# EAGLE design ArduLab (EAGLE 6.5.0)

## Sheet 1 of 2
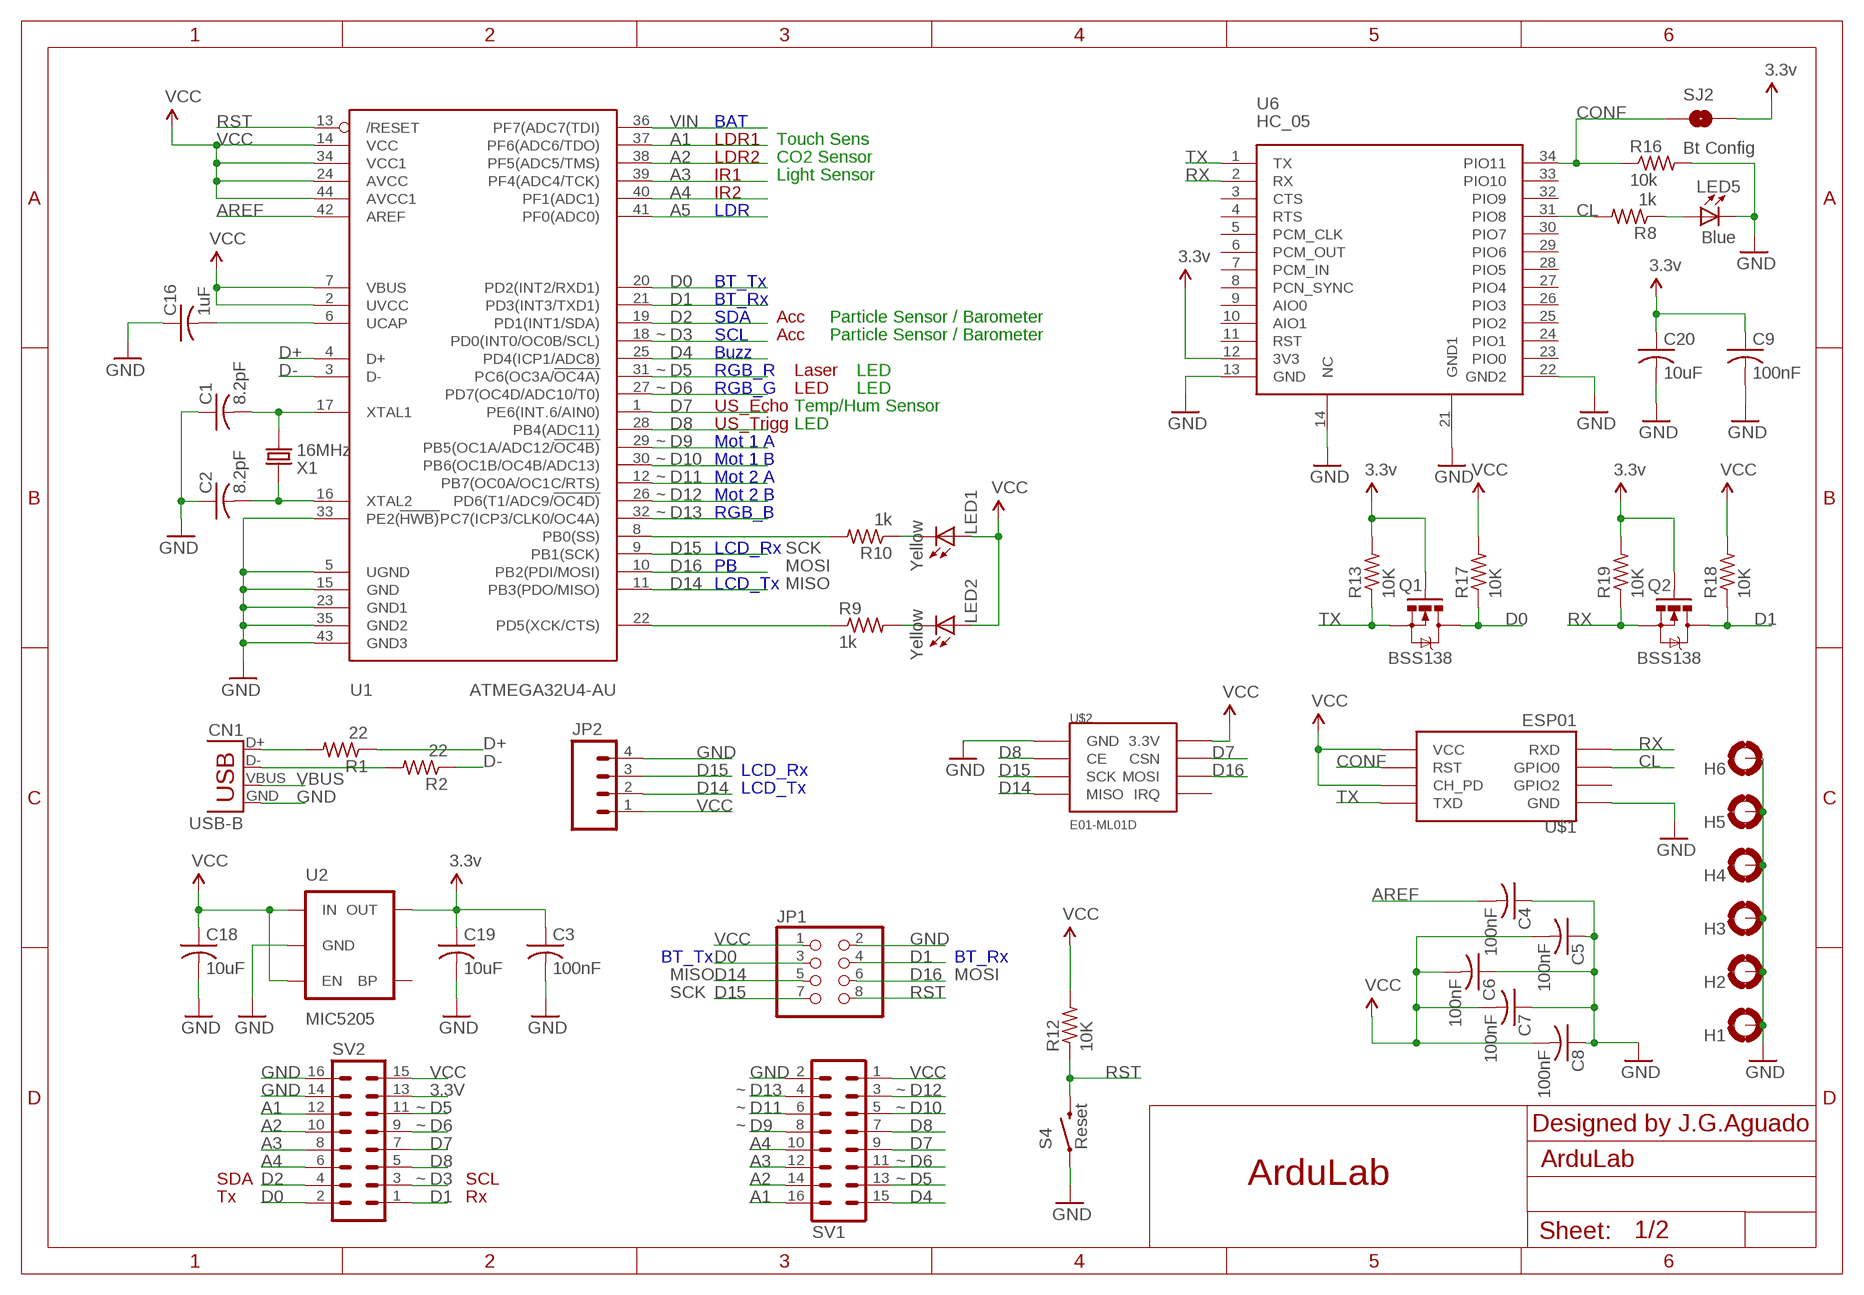
[diagram p0: schematic, sheet 1]

### Parts
C1  8.2pF  C-USC1206  [C1206]
C2  8.2pF  C-USC1206  [C1206]
C3  100nF  C-USC1206  [C1206]
C4  100nF  C-USC1206  [C1206]
C5  100nF  C-USC1206  [C1206]
C6  100nF  C-USC1206  [C1206]
C7  100nF  C-USC1206  [C1206]
C8  100nF  C-USC1206  [C1206]
C9  100nF  C-USC1206  [C1206]
C16  1uF  C-USC1206  [C1206]
C18  10uF  C-USC1206  [C1206]
C19  10uF  C-USC1206  [C1206]
C20  10uF  C-USC1206  [C1206]
CN1  USB-B  USBPTH  [USB-B-PTH]
H1  MOUNT-PAD-ROUND3.2  [3,2-PAD]
H2  MOUNT-PAD-ROUND3.2  [3,2-PAD]
H3  MOUNT-PAD-ROUND3.2  [3,2-PAD]
H4  MOUNT-PAD-ROUND3.2  [3,2-PAD]
H5  MOUNT-PAD-ROUND3.2  [3,2-PAD]
H6  MOUNT-PAD-ROUND3.2  [3,2-PAD]
JP1  PINHD-2X4  [2X04]
JP2  M04SMD  [1X04-SMD]
LED1  Yellow  LED1206  [LED1206]
LED2  Yellow  LED1206  [LED1206]
LED5  Blue  LED1206  [LED1206]
Q1  BSS138  MOSFET-NCHANNELSMD  [SOT23-3]
Q2  BSS138  MOSFET-NCHANNELSMD  [SOT23-3]
R1  22  R-US_R1206  [R1206]
R2  22  R-US_R1206  [R1206]
R8  1k  R-US_R1206  [R1206]
R9  1k  R-US_R1206  [R1206]
R10  1k  R-US_R1206  [R1206]
R12  10K  R-US_R1206  [R1206]
R13  10K  R-US_R1206  [R1206]
R16  10k  R-US_R1206  [R1206]
R17  10K  R-US_R1206  [R1206]
R18  10K  R-US_R1206  [R1206]
R19  10K  R-US_R1206  [R1206]
S4  Reset  SWITCH-MOMENTARY-2SMD-4  [TACTILE_SWITCH_TALL]
SJ2  Bt Config  SOLDERJUMPERROUND  [SJ_ROUND]
SV1  MA08-2  [MA08-2]
SV2  MA08-2  [MA08-2]
U1  ATMEGA32U4-AU  [TQFP44]
U2  MIC5205  V_REG_LDOSMD  [SOT23-5]
U6  HC_05  [BLUETOOTH_SMD]
U$1  ESP01  [ESP01]
U$2  E01-ML01D  [E01-ML01D]
X1  16MHz  CRYSTAL'5032'  [2P-SMD-5X3.2]

### Nets
3.3V: C3.1 C9.1 C19.1 C20.1 Q1.1(G) Q2.1(G) R13.2 R19.2 SJ2.2 SV2.13 U2.5(OUT) U6.12(3V3) U$1.CH_PD U$1.VCC U$2.P$2(3.3V) ; supply symbol labelled 3.3v, VCC
A1: SV1.16 SV2.12 U1.37(PF6(ADC6/TDO))
A2: SV1.14 SV2.10 U1.38(PF5(ADC5/TMS))
A3: SV1.12 SV2.8 U1.39(PF4(ADC4/TCK))
A4: SV1.10 SV2.6 U1.40(PF1(ADC1))
A5: U1.41(PF0(ADC0)) ; also sheet 2
AREF: C4.2 U1.42(AREF)
CL: R8.2 U6.31(PIO8) U$1.GPIO0
CONF: R16.1 SJ2.1 U6.34(PIO11) U$1.RST
D0: JP1.3 Q1.3(D) R17.1 SV2.2 U1.20(PD2(INT2/RXD1))
D1: JP1.4 Q2.3(D) R18.1 SV2.1 U1.21(PD3(INT3/TXD1))
D2: SV2.4 U1.19(PD1(INT1/SDA))
D3: SV2.3 U1.18(PD0(INT0/OC0B/SCL))
D4: SV1.15 U1.25(PD4(ICP1/ADC8)) ; also sheet 2
D5: SV1.13 SV2.11 U1.31(PC6(OC3A/!OC4A)) ; also sheet 2
D6: SV1.11 SV2.9 U1.27(PD7(OC4D/ADC10/T0)) ; also sheet 2
D7: SV1.9 SV2.7 U1.1(PE6(INT.6/AIN0)) U$2.P$4(CSN)
D8: SV1.7 SV2.5 U1.28(PB4(ADC11)) U$2.P$3(CE)
D9: SV1.8 U1.29(PB5(OC1A/ADC12/!OC4B)) ; also sheet 2
D10: SV1.5 U1.30(PB6(OC1B/OC4B/ADC13)) ; also sheet 2
D11: SV1.6 U1.12(PB7(OC0A/OC1C/RTS)) ; also sheet 2
D12: SV1.3 U1.26(PD6(T1/ADC9/!OC4D)) ; also sheet 2
D13: SV1.4 U1.32(PC7(ICP3/CLK0/OC4A)) ; also sheet 2
D14: JP1.5 JP2.2 U1.11(PB3(PDO/MISO)) U$2.P$7(MISO)
D15: JP1.7 JP2.3 U1.9(PB1(SCK)) U$2.P$5(SCK)
D16: JP1.6 U1.10(PB2(PDI/MOSI)) U$2.P$6(MOSI) ; also sheet 2
D17/PB0/RXLED: R10.2 U1.8(PB0(SS))
D+: R1.1 U1.4(D+)
D-: R2.1 U1.3(D-)
GND: C1.1 C2.1 C3.2 C4.1 C5.1 C6.1 C7.1 C8.1 C9.2 C16.1 C18.2 C19.2 C20.2 CN1.GND H1.B3,2(MOUNT) H2.B3,2(MOUNT) H3.B3,2(MOUNT) H4.B3,2(MOUNT) H5.B3,2(MOUNT) H6.B3,2(MOUNT) JP1.2 JP2.4 LED5.C R16.2 S4.A2 SV1.2 SV2.14 SV2.16 U1.5(UGND) U1.15(GND) U1.23(GND1) U1.33(PE2(!HWB)) U1.35(GND2) U1.43(GND3) U2.2(GND) U6.13(GND) U6.14(NC) U6.21(GND1) U6.22(GND2) U$1.GND U$2.P$1(GND) ; also sheet 2
N$2: C1.2 U1.17(XTAL1) X1.2
N$5: C2.2 U1.16(XTAL2) X1.1
N$6: LED2.C R9.2
N$8: LED1.C R10.1
N$12: CN1.D+ R1.2
N$13: CN1.D- R2.2
N$19: LED5.A R8.1
PD5/TXLED: R9.1 U1.22(PD5(XCK/CTS))
RST: JP1.8 R12.1 S4.B2 U1.13(/RESET)
RX: Q2.2(S) R19.1 U6.2(RX) U$1.RX(RXD)
TX: Q1.2(S) R13.1 U6.1(TX) U$1.TX(TXD)
UCAP: C16.2 U1.6(UCAP)
VBUS: CN1.VBUS ; also sheet 2
VCC: C5.2 C6.2 C7.2 C8.2 C18.1 JP1.1 JP2.1 LED1.A LED2.A R12.2 R17.2 R18.2 SV1.1 SV2.15 U1.2(UVCC) U1.7(VBUS) U1.14(VCC) U1.24(AVCC) U1.34(VCC1) U1.44(AVCC1) U2.1(IN) U2.3(EN) ; also sheet 2
VIN: U1.36(PF7(ADC7(TDI)) ; also sheet 2
Unconnected: U2.4(BP) U6.3(CTS) U6.4(RTS) U6.5(PCM_CLK) U6.6(PCM_OUT) U6.7(PCM_IN) U6.8(PCN_SYNC) U6.9(AIO0) U6.10(AIO1) U6.11(RST) U6.23(PIO0) U6.24(PIO1) U6.25(PIO2) U6.26(PIO3) U6.27(PIO4) U6.28(PIO5) U6.29(PIO6) U6.30(PIO7) U6.32(PIO9) U6.33(PIO10) U$1.GPIO2 U$2.P$8(IRQ)

### Notes on the sheet
- BAT
- LDR1 | Touch Sens
- LDR2 | CO2 Sensor
- IR1 | Light Sensor
- IR2
- LDR
- BT_Tx
- BT_Rx
- SDA | Acc | Particle Sensor / Barometer
- ~ | SCL | Acc | Particle Sensor / Barometer
- Buzz
- ~ | RGB_R | Laser | LED
- ~ | RGB_G | LED | LED
- US_Echo | Temp/Hum Sensor
- US_Trigg | LED
- ~ | Mot 1 A
- ~ | Mot 1 B
- ~ | Mot 2 A
- ~ | Mot 2 B
- ~ | RGB_B
- LCD_Rx | SCK
- PB | MOSI
- LCD_Tx | MISO
- LCD_Rx
- LCD_Tx
- BT_Tx | BT_Rx
- MISO | MOSI
- SCK
- ~ | ~
- ~ | ~ | ~
- ~ | ~ | Designed by J.G.Aguado
- ~
- SDA | ~ | SCL | ~ | ArduLab
- Tx | Rx

## Sheet 2 of 2
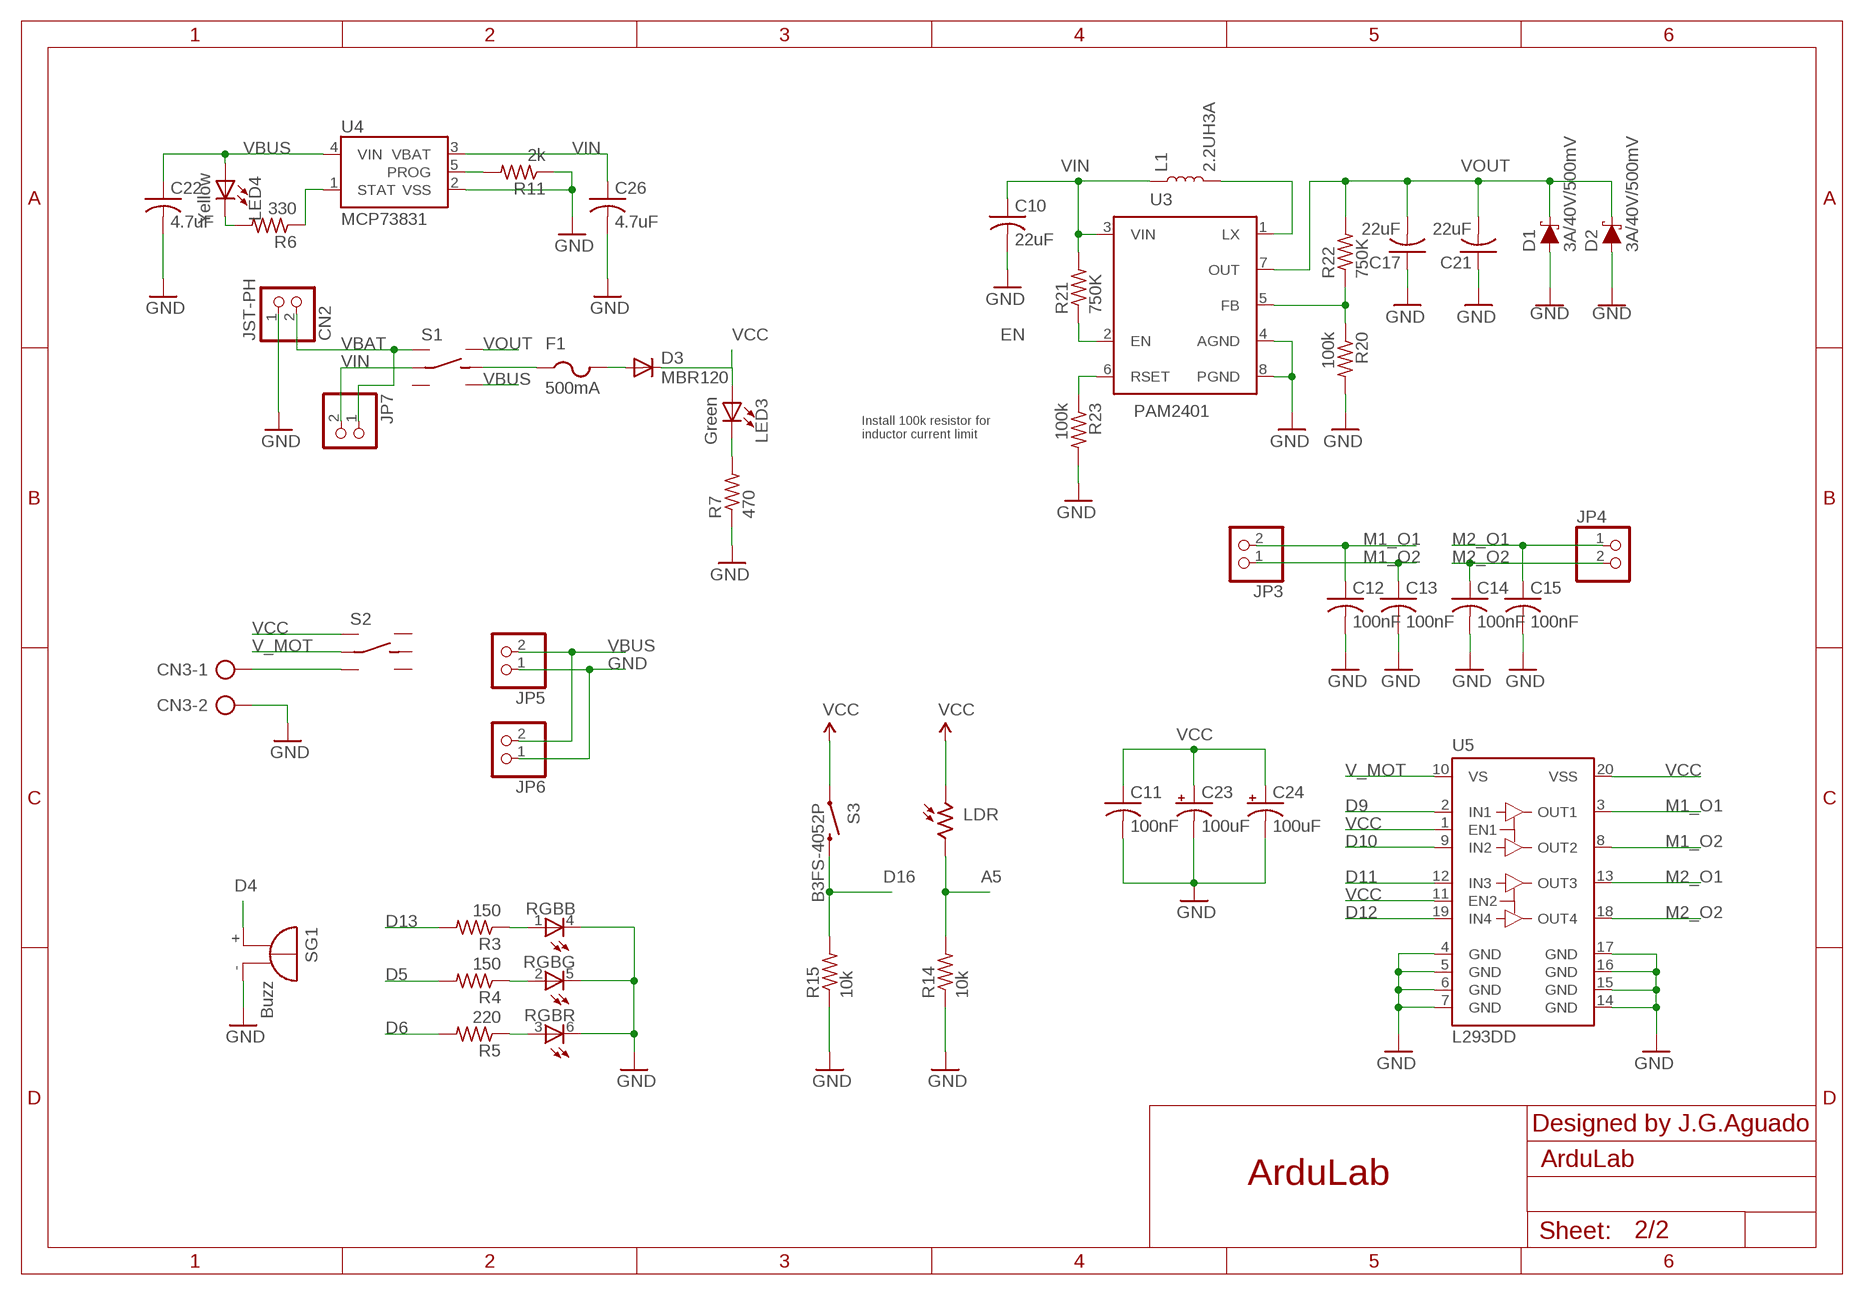
[diagram p1: schematic, sheet 2]

### Parts
C10  22uF  C-USC1206  [C1206]
C11  100nF  C-USC1206  [C1206]
C12  100nF  C-USC1206  [C1206]
C13  100nF  C-USC1206  [C1206]
C14  100nF  C-USC1206  [C1206]
C15  100nF  C-USC1206  [C1206]
C17  22uF  C-USC1206  [C1206]
C21  22uF  C-USC1206  [C1206]
C22  4.7uF  C-USC3216  [C3216]
C23  100uF  CAP_POL3528-KIT  [EIA3528-KIT]
C24  100uF  CAP_POL3528-KIT  [EIA3528-KIT]
C26  4.7uF  C-USC3216  [C3216]
CN2  JST-PH  JST_2PIN-SMT  [JST-PH-2-SMT]
CN3  AK500/2  [AK500/2]
D1  3A/40V/500mV  DIODE-SCHOTTKY-B340A  [SMA-DIODE]
D2  3A/40V/500mV  DIODE-SCHOTTKY-B340A  [SMA-DIODE]
D3  MBR120  DIODE-SOD123  [SOD123]
F1  500mA  PTCFUSE-1206  [R1206]
JP3  PINHD-1X2  [1X02]
JP4  PINHD-1X2  [1X02]
JP5  PINHD-1X2  [1X02]
JP6  PINHD-1X2  [1X02]
JP7  PINHD-1X2  [1X02]
L1  2.2UH3A  INDUCTOR-IFSC1515AHER2R2M01  [INDUCTOR_4X4MM]
LDR  VT20N1  [TO46-VT200]
LED3  Green  LED1206  [LED1206]
LED4  Yellow  LED1206  [LED1206]
R3  150  R-US_R1206  [R1206]
R4  150  R-US_R1206  [R1206]
R5  220  R-US_R1206  [R1206]
R6  330  R-US_R1206  [R1206]
R7  470  R-US_R1206  [R1206]
R11  2k  R-US_R1206  [R1206]
R14  10k  R-US_R1206  [R1206]
R15  10k  R-US_R1206  [R1206]
R20  100k  R-US_R1206  [R1206]
R21  750K  R-US_R1206  [R1206]
R22  750K  R-US_R1206  [R1206]
R23  100k  R-US_R1206  [R1206]
RGB  OVSTRGBBCR8_V2  [OVSTRGBBCR8_V2]
S1  DPDT_JS202011CQN  [DPDT_JS202011CQN]
S2  DPDT_JS202011CQN  [DPDT_JS202011CQN]
S3  B3FS-4052P  SWITCH-MOMENTARY-2SMD-12MM  [TACTILE-SMD-12MM]
SG1  Buzz  F/HMB  [F/HMB]
U3  PAM2401  [MSOP8]
U4  MCP73831  [SOT23-5]
U5  L293DD  [SO20]

### Nets
A5: LDR.2 R14.2 ; also sheet 1
D4: SG1.+ ; also sheet 1
D5: R4.2 ; also sheet 1
D6: R5.2 ; also sheet 1
D9: U5.2(IN1) ; also sheet 1
D10: U5.9(IN2) ; also sheet 1
D11: U5.12(IN3) ; also sheet 1
D12: U5.19(IN4) ; also sheet 1
D13: R3.2 ; also sheet 1
D16: R15.2 S3.3 ; also sheet 1
EN: R21.1 U3.2(EN)
GND: C10.2 C11.2 C12.2 C13.2 C14.2 C15.2 C17.1 C21.1 C22.2 C23.C(-) C24.C(-) C26.2 CN2.1 CN3.2 D1.A D2.A JP5.1 JP6.1 R7.1 R11.1 R14.1 R15.1 R20.2 R23.2 RGB.4(B:C) RGB.5(G:C) RGB.6(R:C) SG1.- U3.4(AGND) U3.8(PGND) U4.2(VSS) U5.4(GND) U5.5(GND) U5.6(GND) U5.7(GND) U5.14(GND) U5.15(GND) U5.16(GND) U5.17(GND) ; also sheet 1
M1_O1: C12.1 JP3.2 U5.3(OUT1)
M1_O2: C13.1 JP3.1 U5.8(OUT2)
M2_O1: C15.1 JP4.1 U5.13(OUT3)
M2_O2: C14.1 JP4.2 U5.18(OUT4)
N$1: R20.1 R22.1 U3.5(FB)
N$3: F1.1 S1.5(RC)
N$4: L1.P$2 U3.1(LX)
N$7: R23.1 U3.6(RSET)
N$9: LED4.C R6.2
N$10: R11.2 U4.5(PROG)
N$11: R6.1 U4.1(STAT)
N$14: LED3.C R7.2
N$15: D3.A F1.2
N$308: R3.1 RGB.1(B:A)
N$309: R4.1 RGB.2(G:A)
N$310: R5.1 RGB.3(R:A)
V_AUX: CN3.1 S2.3(L2)
V_MOT: S2.2(LC) U5.10(VS)
VBAT: CN2.2 JP7.1 S1.1(L1)
VBUS: C22.1 JP5.2 JP6.2 LED4.A S1.6(R2) U4.4(VIN) ; also sheet 1
VCC: C11.1 C23.A(+) C24.A(+) D3.C LDR.1 LED3.A S2.1(L1) S3.1 U5.1(EN1) U5.11(EN2) U5.20(VSS) ; also sheet 1
VIN: C10.1 C26.1 JP7.2 L1.P$1 R21.2 S1.2(LC) U3.3(VIN) U4.3(VBAT) ; also sheet 1
VOUT: C17.2 C21.2 D1.C D2.C R22.2 S1.4(R1) U3.7(OUT)
Unconnected: S1.3(L2) S2.4(R1) S2.5(RC) S2.6(R2)

### Notes on the sheet
- Install 100k resistor for
  inductor current limit
- Designed by J.G.Aguado
- ArduLab

## Library data of the parts
C1-C22 C26 = resistor:C-US: CAPACITOR, American symbol
C23 C24 = SparkFun:CAP_POL: Capacitor Polarized These are standard SMD and PTH capacitors. Normally 10uF, 47uF, and 100uF in electrolytic and tantalum varieties. Always verify the external diameter of the through hole cap, it varies with capacity, voltage, and manufacturer. The EIA devices should be standard.
CN1 = SparkFun-Connectors:USB: USB Connectors USB-B-PTH is fully proven SKU : PRT-00139/CONN-08278 USB-miniB is fully proven SKU : PRT-00587 USB-A-PCB is untested. USB-A-H is throughly reviewed, but untested. Spark Fun Electronics SKU : PRT-00437 USB-B-SMT is throughly reviewed, but untested. Needs silkscreen touching up. USB-A-S has not been used/tested USB-MB-H has not been used/tested USB-MICROB has been used. CONN-09505; PROD_ID: CONN-08278
CN2 = adafruit:JST_2PIN: JST 2-Pin Connectors of various flavors SMT-RA (S2B-PH-SM4) 4UConnector #17311 SMT (B2B-PH-SM4) THM-RA (S2B-PH) THM (B2B-PH)
CN3 = con-ptr500:AK500/2: CONNECTOR; OC_FARNELL: unknown; OC_NEWARK: unknown
D1 D2 = SparkFun-DiscreteSemi:DIODE-SCHOTTKY: Schottky diode A Schottky diode is a semiconductor diode which has a low forward voltage drop and a very fast switching action.; PROD_ID: DIO-09886
D3 = diode:DIODE-: DIODE
F1 = adafruit:PTCFUSE: PTC fuses, resettable thermistors
H1-H6 = holes:MOUNT-PAD-ROUND: MOUNTING PAD, round
JP1 = pinhead:PINHD-2X4: PIN HEADER
JP2 = SparkFun-Connectors:M04: Header 4 Standard 4-pin 0.1" header. Use with straight break away headers (SKU : PRT-00116), right angle break away headers (PRT-00553), swiss pins (PRT-00743), machine pins (PRT-00117), and female headers (PRT-00115). Molex polarized connector foot print use with SKU : PRT-08231 with associated crimp pins and housings. 1MM SMD Version SKU: PRT-10208
JP3-JP7 = pinhead:PINHD-1X2: PIN HEADER
L1 = SparkFun-Coils:INDUCTOR: Inductors Resist changes in electrical current. Basically a coil of wire. SparkFun Products: SparkFun Load Cell Amplifier - HX711 <https://www.sparkfun.com/products/13879> IOIO-OTG - V2.2 <https://www.sparkfun.com/products/13613>; PROD_ID: NDUC-13770
LDR = photo-elements:VT2*: Photoconductive Cell VT200 Series Source: http://optoelectronics.perkinelmer.com/content/Datasheets/DTS_vt200seriesdatasheet.pdf
LED1-LED5 = SpaceDIY_passive_components:LED1206
Q1 Q2 = SparkFun:MOSFET-NCHANNEL
R1-R23 = resistor:R-US_: RESISTOR, American symbol
RGB = led:OVSTRGBBCR8_V2
S1 S2 = bt_electromech:DPDT: Dual Position, Dual Throw (DPDT) Switch
S3 = SparkFun-Electromechanical:SWITCH-MOMENTARY-2: Various NO switches- pushbuttons, reed, etc
S4 = Testing:SWITCH-MOMENTARY-2: Various NO switches- pushbuttons, reed, etc
SG1 = buzzer:F/HMB: BUZZER Source: Buerklin; OC_FARNELL: unknown; OC_NEWARK: unknown
SJ2 = SparkFun-Retired:SOLDERJUMPER: Solder Jumper Standard SMD solder jumper. Used to automate production. Two varients : Normally Open and Normally Closed are the same, but have different paste layers. NC will have a large amount of paste and should jumper during reflow.
SV1 SV2 = con-lstb:MA08-2: PIN HEADER; OC_FARNELL: unknown; OC_NEWARK: unknown
U1 = adafruit:ATMEGA32U4: http://www.ladyada.net/library/eagle
U2 = SparkFun:V_REG_LDO: Voltage Regulator LDO Standard 150mA LDO voltage regulator in SOT-23 layout. Micrel part MIC5205. BP (by-pass) pin is used to lower output noise with 470pF cap.
U3 = SparkFun-IC-Power:PAM2401: PAM2401 - Boost PMIC Specifications: Up to 1A output current 0.9V to 4.75V Input Range 2.5V to 5.0V Adjustable Output Voltage Datasheet <https://www.diodes.com/assets/Datasheets/PAM2401.pdf> (Diodes inc.); PROD_ID: IC-13769
U4 = SparkFun-PowerIC:MCP73831: Miniature single cell, fully integrated Li-Ion, Li-polymer charge management controller http://ww1.microchip.com/downloads/en/DeviceDoc/20001984g.pdf IC-09995; PROD_ID: IC-09995
U5 = st-microelectronics:L293DD: PUSH-PULL FOUR CHANNEL DRIVER WITH DIODES Source: http://www.st.com/stonline/books/pdf/docs/1330.pdf; OC_FARNELL: unknown
U6 = Bluetooth HC-05:HC_05: HC-05 Bluetooth Module
U$1 = esp8266modules:ESP01: ESP8266 Wifi module 01
U$2 = SpaceDIY_connectors:E01-ML01D: E01-ML01D 2.4 GHz RF Transceptor Module Based on the nRF24L01+ IC
X1 = Discrete:CRYSTAL*: CRYSTAL

## Net classes
0 default: width 0.152 mm, drill 0.305 mm, clearance 0.152 mm
1 vcc: width 0.254 mm

## Board
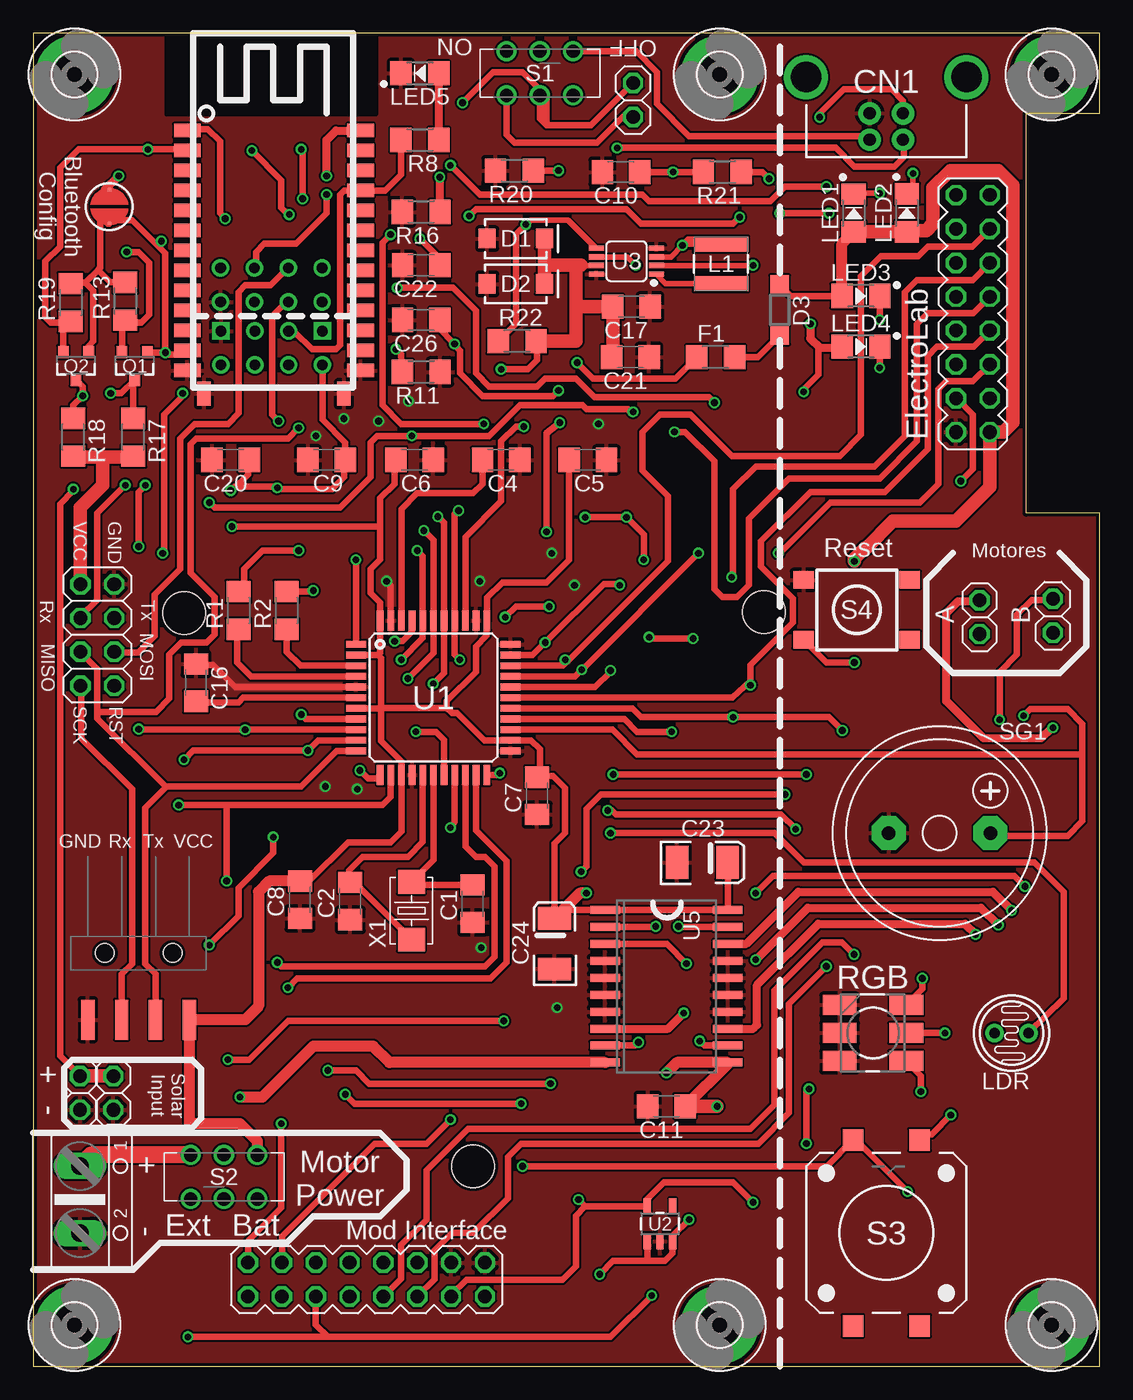
[diagram p2: board, top side]
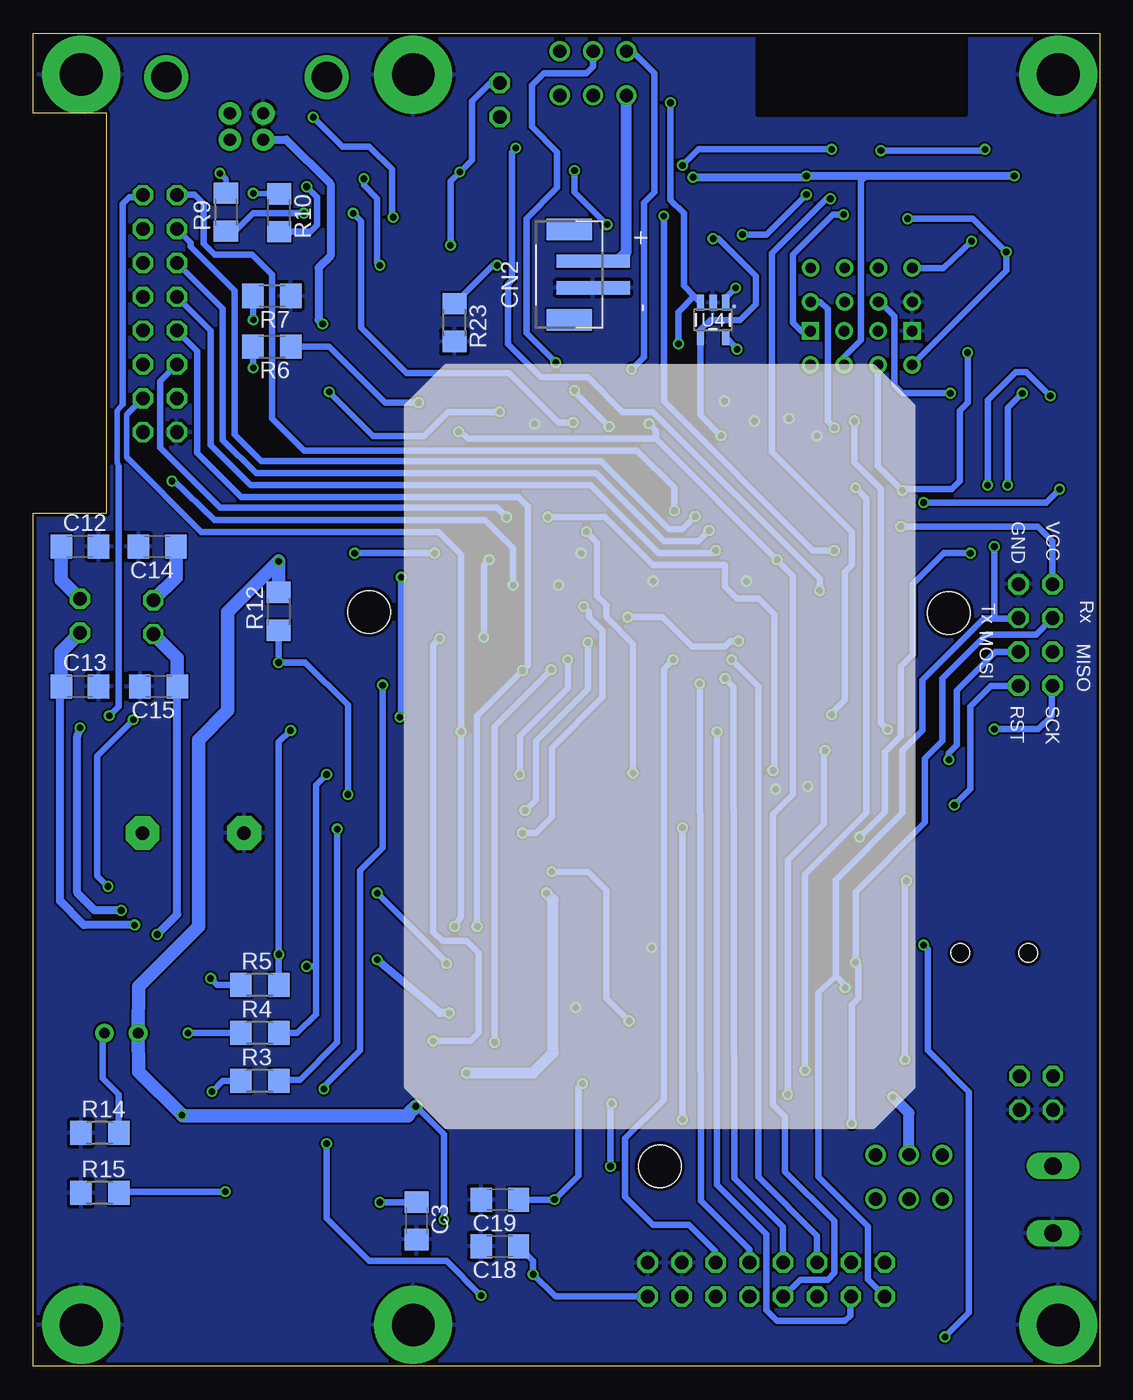
[diagram p3: board, bottom side, seen from below]

Size 80 x 100 mm. Coordinates in mm from the lower left corner, seen from the top.
Outline: 0,0 80,0 80,64 74.5,64 74.5,94 80,94 80,100 0,100 0,0
Copper layers (1*16): Top 0.035mm / dielectric 1.5mm / Bottom 0.035mm
Design rules "ITead_rule": minimum track width 6mil, minimum drill 12mil, track to track 6mil, track to pad 6mil, pad to pad 6mil, via to via 6mil, smd to smd 0mil, copper to edge 10mil, drill to drill 10mil, minimum pad ring 10mil, minimum via ring 6mil, stop-mask expansion 2mil, vias tented up to drill 100mil, thermal gap 10mil
Holes 3.2 mm at 54.8,56.6 11.3,56.5 33,15
tRestrict: area 10,93.9 to 25.7,100
bRestrict: area 10,93.9 to 25.7,100

### Footprints (pad centres in the part's own frame; a part is rotated, then mirrored left to right if it is on the bottom)
C1206 = smd 1.6 x 1.8: 1 -1.4,0; 2 1.4,0
C3216 = smd 1.6 x 1.8: 1 -1.4,0; 2 1.4,0
EIA3528-KIT = smd 1.7 x 2.5: A 1.9,0; C -1.9,0
USB-B-PTH = drill 0.914 pad 1.676: D+ 0,1.25; D- 1.981,1.25; GND 0,-1.25; VBUS 1.981,-1.25 | drill 2.286: S1 -2.718,-6.02; S2 -2.718,6.02
JST-PH-2-SMT = smd 1 x 5.5: 1 -1,-1.8; 2 1,-1.8 | smd 1.6 x 3.4: NC1 -3.4,0; NC2 3.4,0
AK500/2 = drill 1.321 long: 1 -2.515,0; 2 2.515,0
SMA-DIODE = smd 1.27 x 1.47: A -2.15,0; C 2.15,0
SOD123 = smd 1.4 x 1.4: A 1.9,0; C -1.9,0
R1206 = smd 1.6 x 1.803: 1 -1.422,0; 2 1.422,0
3,2-PAD = drill 3.2 pad 5.842: B3,2 0,0
2X04 = drill 1.016 octagon: 1 -3.81,-1.27; 2 -3.81,1.27; 3 -1.27,-1.27; 4 -1.27,1.27; 5 1.27,-1.27; 6 1.27,1.27; 7 3.81,-1.27; 8 3.81,1.27
1X04-SMD = smd 1 x 3: 1 -3.81,5; 2 -1.27,5; 3 1.27,5; 4 3.81,5 | hole 1.4: -2.54,0; 2.54,0
1X02 = drill 1.016 octagon: 1 -1.27,0; 2 1.27,0
INDUCTOR_4X4MM = smd 4.089 x 1.143: P$1 0,1.473; P$2 0,-1.473
TO46-VT200 = drill 0.8 pad 1.4: 1 -1.27,0; 2 1.27,0
LED1206 = smd 1.6 x 1.803: A -1.422,0; C 1.422,0
SOT23-3 = smd 0.8 x 0.9: 1 -0.95,-1; 2 0.95,-1; 3 0,1.1
OVSTRGBBCR8_V2 = smd 2.54 x 1.5: 1 -2.5,2.1; 2 -2.5,0; 3 -2.5,-2.1; 4 2.5,2.1; 5 2.5,0; 6 2.5,-2.1
DPDT_JS202011CQN = drill 1: 1 -2.5,-1.65; 2 0,-1.651; 3 2.5,-1.65; 4 -2.5,1.65; 5 0,1.651; 6 2.5,1.65
TACTILE-SMD-12MM = smd 1.6 x 1.55: 1 6.975,-2.5; 2 -6.975,-2.5; 3 6.975,2.5; 4 -6.975,2.5
TACTILE_SWITCH_TALL = smd 1.55 x 1.3: A1 -3.975,-2.25; A2 3.975,-2.25; B1 -3.975,2.25; B2 3.975,2.25
F/HMB = drill 1.016 pad 2.54 octagon: + 3.81,0; - -3.81,0
SJ_ROUND = smd 0.152 x 0.305: 1 -1.27,0; 2 1.27,0
MA08-2 = drill 1.016 octagon: 1 -8.89,-1.27; 2 -8.89,1.27; 3 -6.35,-1.27; 4 -6.35,1.27; 5 -3.81,-1.27; 6 -3.81,1.27; 7 -1.27,-1.27; 8 -1.27,1.27; 9 1.27,-1.27; 10 1.27,1.27; 11 3.81,-1.27; 12 3.81,1.27; 13 6.35,-1.27; 14 6.35,1.27; 15 8.89,-1.27; 16 8.89,1.27
TQFP44 = smd 1.5 x 0.5: 1 -5.8,4; 2 -5.8,3.2; 3 -5.8,2.4; 4 -5.8,1.6; 5 -5.8,0.8; 6 -5.8,0; 7 -5.8,-0.8; 8 -5.8,-1.6; 9 -5.8,-2.4; 10 -5.8,-3.2; 11 -5.8,-4; 23 5.8,-4; 24 5.8,-3.2; 25 5.8,-2.4; 26 5.8,-1.6; 27 5.8,-0.8; 28 5.8,0; 29 5.8,0.8; 30 5.8,1.6; 31 5.8,2.4; 32 5.8,3.2; 33 5.8,4 | smd 0.5 x 1.5: 12 -4,-5.8; 13 -3.2,-5.8; 14 -2.4,-5.8; 15 -1.6,-5.8; 16 -0.8,-5.8; 17 0,-5.8; 18 0.8,-5.8; 19 1.6,-5.8; 20 2.4,-5.8; 21 3.2,-5.8; 22 4,-5.8; 34 4,5.8; 35 3.2,5.8; 36 2.4,5.8; 37 1.6,5.8; 38 0.8,5.8; 39 0,5.8; 40 -0.8,5.8; 41 -1.6,5.8; 42 -2.4,5.8; 43 -3.2,5.8; 44 -4,5.8
SOT23-5 = smd 0.55 x 1.2: 1 -0.95,-1.3; 2 0,-1.3; 3 0.95,-1.3; 4 0.95,1.3; 5 -0.95,1.3
MSOP8 = smd 0.4 x 1.1: 1 -0.975,-2.25; 2 -0.325,-2.25; 3 0.325,-2.25; 4 0.975,-2.25; 5 0.975,2.25; 6 0.325,2.25; 7 -0.325,2.25; 8 -0.975,2.25
SO20 = smd 0.6 x 2.2: 1 -5.715,-4.6; 2 -4.445,-4.6; 3 -3.175,-4.6; 4 -1.905,-4.6; 5 -0.635,-4.6; 6 0.635,-4.6; 7 1.905,-4.6; 8 3.175,-4.6; 9 4.445,-4.6; 10 5.715,-4.6; 11 5.715,4.6; 12 4.445,4.6; 13 3.175,4.6; 14 1.905,4.6; 15 0.635,4.6; 16 -0.635,4.6; 17 -1.905,4.6; 18 -3.175,4.6; 19 -4.445,4.6; 20 -5.715,4.6
BLUETOOTH_SMD = smd 2 x 1: 1 -6.35,3.81; 2 -6.35,2.31; 3 -6.35,0.81; 4 -6.35,-0.69; 5 -6.35,-2.19; 6 -6.35,-3.69; 7 -6.35,-5.19; 8 -6.35,-6.69; 9 -6.35,-8.19; 10 -6.35,-9.69; 11 -6.35,-11.19; 12 -6.35,-12.69; 13 -6.35,-14.19; 22 6.65,-14.19; 23 6.65,-12.69; 24 6.65,-11.19; 25 6.65,-9.69; 26 6.65,-8.19; 27 6.65,-6.69; 28 6.65,-5.19; 29 6.65,-3.69; 30 6.65,-2.19; 31 6.65,-0.69; 32 6.65,0.81; 33 6.65,2.31; 34 6.65,3.81 | smd 1 x 1.8: 14 -5.1,-15.94; 21 5.4,-15.94
ESP01 = drill 0.8: CH_PD -1.285,-8.178; GPIO0 1.255,-5.638; GPIO2 -1.285,-5.638; RST 1.255,-8.178; TX -3.825,-8.178; VCC 3.795,-8.178 | drill 0.8 square: GND -3.825,-5.638; RX 3.795,-5.638
E01-ML01D = drill 0.8: P$1 2.45,1.25; P$2 2.45,3.79; P$3 4.99,1.25; P$4 4.99,3.79; P$5 7.53,1.25; P$6 7.53,3.79; P$7 10.07,1.25; P$8 10.07,3.79
2P-SMD-5X3.2 = smd 1.778 x 2.032: 1 -2.159,0; 2 2.159,0

### Placement (x,y rotation side)
C1  32.97,34.7 90 top
C2  23.77,34.89 90 top
C3  51.25,10.91 270 bottom
C4  35.1,68 180 top
C5  41.6,68 180 top
C6  28.6,68 180 top
C7  37.8,42.8 90 top
C8  20,35 90 top
C9  22,68 180 top
C10  44.1,89.6 180 top
C11  47.5,19.5 180 top
C12  76.5,61.5 0 bottom
C13  76.5,51 0 bottom
C14  70.7,61.5 180 bottom
C15  70.6,51 180 bottom
C16  12.2,51.28 270 top
C17  44.88,79.48 180 top
C18  45,9 180 bottom
C19  45,12.5 180 bottom
C20  14.8,68 180 top
C21  44.8,75.7 180 top
C22  29.1,82.6 180 top
C23  50.2,37.8 0 top
C24  39.1,31.7 90 top
C26  29.1,78.5 180 top
CN1  64,94 270 top
CN2  39.8,81.9 90 bottom
CN3  3.5,12.5 270 top
D1  36.2,84.6 0 top
D2  36.2,81.2 0 top
D3  56,79.25 270 top
F1  51.2,75.7 0 top
H1  76.4,3.1 0 top
H2  3.1,3.1 0 top
H3  3.1,96.9 0 top
H4  51.5,96.9 0 top
H5  76.4,96.9 0 top
H6  51.5,3.1 0 top
JP1  4.8,54.86 270 top
JP2  7.9,31 180 top
JP3  76.5,56.3 90 top
JP4  71,56.2 90 top
JP5  3.5,20.5 90 top
JP6  6,20.5 90 top
JP7  45,95 90 top
L1  51.6,82.7 0 top
LDR  73.4,25 0 top
LED1  61.55,86.51 90 top
LED2  65.55,86.53 90 top
LED3  62.1,80.3 0 top
LED4  62.1,76.5 0 top
LED5  29,97 180 top
Q1  7.6,75.1 180 top
Q2  3.2,75.1 180 top
R1  15.4,56.7 90 top
R2  19,56.7 90 top
R3  63,21.4 0 bottom
R4  63,25 0 bottom
R5  63,28.6 0 bottom
R6  62.1,76.5 180 bottom
R7  62.1,80.3 180 bottom
R8  29,92 180 top
R9  65.55,86.58 90 bottom
R10  61.55,86.54 270 bottom
R11  29.1,74.6 180 top
R12  61.6,56.63 90 bottom
R13  6.9,79.9 90 top
R14  75,17.5 0 bottom
R15  75,13 0 bottom
R16  29.1,86.6 180 top
R17  7.5,69.7 270 top
R18  3,69.7 270 top
R19  2.8,79.8 90 top
R20  36.1,89.7 180 top
R21  51.7,89.6 180 top
R22  36.3,76.9 0 top
R23  48.4,78.3 270 bottom
RGB  63,25 180 top
S1  38,97 0 top
S2  14.3,14.2 180 top
S3  64,10 90 top
S4  61.78,56.75 180 top
SG1  68,40 0 top
SJ2  5.7,87 270 top
SV1  70.5,78.97 90 top
SV2  25,6.5 0 top
U1  30.02,50.16 0 top
U2  47.02,10.68 0 top
U3  44.5,82.9 90 top
U4  29,78.5 180 bottom
U5  47.5,28.5 270 top
U6  17.9,88.9 0 top
U$1  17.9,83.3 0 top
U$2  11.6,78.6 0 top
X1  28.37,34.17 90 top

### Tracks (layer width: path | path; a pad name or v marks a point on that pad's centre or on a via)
3.3V  (via drill 0.5)
  Top 0.406: 41.45,11.98 41.38,11.98 41.38,12.02 v40.9,12.5
  Top 0.5: 41.45,11.98 U2.5 46.07,12.57 47.3,13.8 52.5,13.8 v54,12.3 | v38.8,21.2 25.2,21.2 24.2,22.2 v22.1,22.2 | 18.2,65.8 18.2,66 | 18.2,66 v18.3,65.9 18.4,65.8 22.4,65.8 23.3,66.7 23.3,68.1 C9.1 23.4,69.3 21.7,71 U$1.VCC | 5,86.3 SJ2.2 | SJ2.2 5.57,85.73 5,86.3 | 7.48,81.9 R13.2 5.78,81.32 4.85,82.25 | Q2.1 4.15,76.55 4.5,76.9 4.5,80.7 3.9,81.3 | 5,86.3 5,82.4 4.85,82.25 | 4.85,82.25 3.9,81.3 | v9.9,76.05 8.6,76.05 Q1.1 | v9.9,76.05 9.9,83.5 9.4,84 | 9.4,84 7.4,86 5.97,86 SJ2.2 | 3.9,81.3 2.88,81.3 R19.2 | 41.38,11.98 40.7,11.3 40.7,7.5 39.7,6.5 32.5,6.5 31.35,5.35 SV2.13 | v9.9,76.05 9.9,75.9 12.1,75.9 12,76.3 12.1,76.21 U6.12 | v9.6,84.4 9.7,84.4 9.4,84 | 18.2,66 15.1,66 v14.8,65.7 14.8,65.8 15,65.8 16.1,66.9 16.1,67.9 C20.1
  Bottom 0.5: v54,12.3 C3.1 | C19.1 v40.9,12.5 39.1,14.3 39.1,20.9 v38.8,21.2 | v22.1,22.2 22.1,36.9 17.5,41.5 17.5,65.1 v18.3,65.9 | U$2.P$2 11.71,82.39 v9.6,84.4 | v9.9,76.05 9.9,72.3 10.5,71.7 10.5,66.4 11.1,65.8 14.7,65.8 v14.8,65.7 16.61,67.52 U$1.CH_PD
A1  (via drill 0.5)
  Top 0.5: v31.9,64.2 31.62,63.92 U1.37 31.62,53.38 v32,53
  Bottom 0.406: 69.19,87.9 SV1.16
  Bottom 0.5: v31.9,64.2 31.9,65.9 34.7,68.7 59.7,68.7 62.1,71.1 62.1,81.9 63.6,83.4 66.4,83.4 67.2,84.2 67.2,87.2 67.9,87.9 69.19,87.9 | 32.54,52.46 v32,53 32.7,52.3 32.7,20 35.6,17.1 35.6,12.7 33.5,10.6 30.8,10.6 28.84,8.64 28.84,7.8 SV2.12
A2  (via drill 0.5)
  Top 0.5: v30.35,63.75 30.82,63.28 U1.38 30.82,52.02 v30,51.2
  Bottom 0.5: 30.3,63.8 v30.35,63.75 31.3,62.8 32.3,62.8 37.4,67.9 62.9,67.9 64.9,69.9 64.9,80.7 68.2,84 68.2,84.29 SV1.14 | SV2.10 26.27,8.77 29.9,12.4 29.97,51.17 v30,51.2
A3  (via drill 0.5)
  Top 0.5: v29.3,62.7 30.02,61.98 U1.39 30.02,53.52 v28.1,51.6
  Bottom 0.5: 29.2,62.8 v29.3,62.7 30.1,61.9 32.7,61.9 37.8,67 63.3,67 65.8,69.5 65.8,79.35 SV1.12 | v28.1,51.6 27.46,50.96 27.4,14.1 23.76,10.46 23.76,7.8 SV2.8
A4  (via drill 0.5)
  Top 0.5: v28.8,61.2 29.22,60.78 U1.40 29.22,54.62 v27.6,53
  Bottom 0.5: 29.1,61 33.1,61 38.2,66.1 63.7,66.1 66.7,69.1 66.7,77.71 SV1.10 | 29.1,61 29,61 v28.8,61.2 28.9,61.2 29.1,61 | v27.6,53 25.6,51 25.6,14.2 24.9,13.5 25.5,14.1 21.2,9.8 SV2.6
A5  (via drill 0.5)
  Top 0.5: U1.41 28.42,55.12 27.7,54.4 v27.1,54.4 | v43.3,40 55.6,40 57.8,37.8 75.1,37.8 77.3,35.6 77.3,27.6 LDR.2 | v38.7,57 36.2,57 v35.4,56.2
  Bottom 0.5: v43.3,40 42.3,40 41.1,41.2 41.1,46.4 37.3,50.2 37.3,55.2 38.3,56.2 38.3,56.6 v38.7,57 | R14.2 73.58,20.38 74.8,21.6 74.8,25.1 LDR.2 | v35.4,56.2 32.8,56.2 30.6,54 28.1,54 27.7,54.4 v27.1,54.4
AREF
  Top 0.5: U1.42 27.62,64.32 28.8,65.5 33,65.5 33.7,66.2 C4.2
CL
  Top 0.5: R8.2 27.6,91.98 27.6,89.4 26.41,88.21 U6.31 24.31,88.21 24.31,88.2 23.3,88.2 23,87.9 23,76.6 22.7,76.3 20.9,76.3 19.6,77.6 19.5,77.66 U$1.GPIO0
CONF  (via drill 0.5)
  Top 0.5: 24.24,92.7 U6.34
  Top 0.61: R16.1 30.52,89.02 v30.5,89.2 | v22,89.3 22,92 22.7,92.7 24.24,92.7 | SJ2.1 5.37,88.27 v6.4,89.3
  Bottom 0.5: U$1.RST 19.16,75.75 17.9,77 17.9,88.9 17.5,89.3
  Bottom 0.61: v30.5,89.2 22.1,89.2 v22,89.3 17.5,89.3 v6.4,89.3
D0  (via drill 0.5)
  Top 0.5: U1.20 32.42,38.98 33.2,38.2 33.9,38.2 34.6,37.5 34.6,30.7 33.9,30 18.6,30 v18.3,30.3 | JP1.3 3.53,56.23 4.8,57.5 4.8,64 v6.9,66.1 | v5.8,73 6.6,73 Q1.3 7.5,73.9 R17.1 | SV2.2 16.11,9.41 18.6,11.9 v18.6,18.2
  Bottom 0.406: 18.1,30.1 v18.3,30.3
  Bottom 0.5: v18.3,30.3 18.3,35.6 13.1,40.8 13.1,45.6 11.8,46.9 11.8,51.6 8.5,54.9 4.76,54.9 JP1.3 | v6.9,66.1 6.9,71.9 v5.8,73 | 18.1,30.1 18.1,27.6 18.6,27.1 v18.6,18.2
D1  (via drill 0.5)
  Top 0.5: U1.21 33.22,40.18 35.5,37.9 35.5,30.3 34.3,29.1 19.8,29.1 v19.1,28.4 | Q2.3 3.7,73.5 v3.7,72.8 3,72.1 R18.1 | v7.9,61.5 7.9,65.6 v8.4,66.1
  Bottom 0.406: 21.1,28 19.8,29.3
  Bottom 0.5: v19.1,28.4 19.1,28.6 19.8,29.3 19.8,36.5 14.8,41.5 14.8,46.2 13.3,47.7 13.3,51.5 8.7,56.1 7.9,56.1 | JP1.4 6.1,56.1 7.9,56.1 | v3.7,72.8 5.5,74.6 6.3,74.6 8.4,72.5 v8.4,66.1 | 21.1,28 21.1,14.2 17.4,10.5 17.4,6.52 SV2.1 | v7.9,61.5 7.9,56.1
D2  (via drill 0.5)
  Top 0.5: v31.3,18.5 29.5,16.7 25.6,16.7 18.65,9.75 SV2.4 | U1.19 31.62,40.82 v31.3,40.4
  Bottom 0.5: v31.3,18.5 v31.3,40.4
D3  (via drill 0.5)
  Top 0.5: U1.18 30.82,46.98 30.2,47.6 v28.7,47.6
  Bottom 0.5: v28.7,47.6 28.7,13.6 25,9.9 25,4.2 24.2,3.4 19.1,3.4 18.7,3.8 18.7,5.18 SV2.3
D4  (via drill 0.5)
  Top 0.5: SG1.+ 72.01,39.8 77.6,39.8 78.7,40.9 78.7,45.9 | U1.25 43.44,47.76 45.3,45.9 78.7,45.9 | 78.7,45.9 78.7,48.2 77.6,49.3 74.8,49.3 v74.3,48.8
  Bottom 0.406: 73.3,72.2 73.7,71.7 73.7,67.8 73.6,67.5
  Bottom 0.5: v74.3,48.8 73.6,49.5 73.6,67.5 | SV1.15 71.81,87.9 72.01,87.7 72.8,87.7 73.3,87.2 73.3,72.2
D5  (via drill 0.5)
  Top 0.5: U1.31 39.76,52.56 40.25,53.05 | 40.25,53.05 47.6,60.4 47.6,65.3 45.7,67.2 45.7,70.1 47,71.4 49.3,71.4 52.4,68.3 60.5,68.3 62.1,69.9 62.1,81.8 63.6,83.3 66.4,83.3 67.1,84 70.45,84 SV1.13 | v58,44.4 v43.5,44.4 | v39.9,53 40.25,53.05 | v59.5,30 56.7,27.2 56.7,19 54.4,16.7 36.6,16.7 35.6,15.7 35.6,12.6 33,10 31.4,10 30.1,8.7 30.1,6.52 SV2.11
  Bottom 0.5: R4.2 60.2,25 58.8,26.4 58.8,30 | 58.8,30 58.8,43.6 v58,44.4 | v43.5,44.4 43.5,47.3 39.9,50.9 v39.9,53 | v59.5,30 58.8,30
D6  (via drill 0.5)
  Top 0.5: U1.27 44.94,49.36 45.6,48.7 v52.5,48.7 59.7,48.7 v60.7,47.7 | v52.4,59.2 52.5,59.3 52.5,65.8 54.2,67.5 63.1,67.5 65.4,69.8 65.4,80.6 66.3,81.5 70.49,81.5 SV1.11 | v61.58,30.9 60.68,31.8 59.2,31.8 55.6,28.2 55.6,19.6 53.8,17.8 32.6,17.8 29.5,14.7 29.5,11 27.6,9.1 27.6,6.56 SV2.9
  Bottom 0.5: R5.2 v61.58,30.9 61.58,46.82 v60.7,47.7 | v52.4,59.2 52.4,48.8 v52.5,48.7
D7  (via drill 0.5)
  Top 0.5: v48.1,70.1 48.9,70.1 51.1,67.9 51.1,58.3 51.7,57.7 52.8,57.7 53.7,58.6 53.7,63.6 56.7,66.6 63.5,66.6 66.3,69.4 66.3,78.2 67.1,79 70.53,79 SV1.9 | v24.2,60.5 24.2,54.18 U1.1 | v33.8,70.7 27.6,70.7 26.2,72.1 26.2,84.3 v26.8,84.9 | v22,87.9 22,86.5 19.7,84.2 17.3,84.2 16.7,83.6 16.7,82.5 U$2.P$4
  Bottom 0.5: v48.1,70.1 47.9,70.1 47.4,69.6 33.3,69.6 | 33.3,69.6 v24.2,60.5 23,59.3 23,42.9 24.5,41.4 24.5,19.6 23.6,18.7 23.6,14.6 19.9,10.9 19.9,7 20.4,6.5 22.46,6.5 SV2.7 | 33.3,69.6 33.3,70.2 v33.8,70.7 | v26.8,84.9 25,84.9 v22,87.9
D8  (via drill 0.5)
  Top 0.5: 53.8,51.4 52.46,50.16 U1.28 | v58,16.7 58,20.6 v58.2,20.8 | 53.8,51.2 v53.8,51.1 53.8,51.4 | SV1.7 70.57,76.5 67.8,76.5 67.1,75.8 67.1,68.8 63.9,65.6 58.3,65.6 54.6,61.9 54.6,60 57,57.6 57,55.8 53.8,52.6 53.8,51.4 | SV2.5 21.19,3.11 22.1,2.2 | 22.1,2.2 23.5,2.2 43.3,2.2 v46.4,5.3 | v11.2,73 11.2,72.8 9.8,71.4 9.8,61.1 v9.7,61 | v18,39.7 18,38.5 15.4,35.9 15.4,33.8 v13.2,31.6 | v11.6,2.2 22.1,2.2
  Bottom 0.5: v46.4,5.3 49,7.9 54.8,7.9 58,11.1 v58,16.7 | v58.2,20.8 58.2,21 55.5,23.7 55.5,37.2 53.8,38.9 v53.8,51.1 | U$2.P$3 16.45,79.85 15.4,78.8 15.4,73.6 14.8,73 v11.2,73 | v9.7,61 11.7,61 14,58.7 14,53.4 14.9,52.5 14.9,47.3 16.1,46.1 16.1,41.6 v18,39.7 | v13.2,31.6 12.9,31.3 12.9,23.7 9.8,20.6 9.8,4 v11.6,2.2
D9  (via drill 0.5)
  Top 0.5: U1.29 42.16,50.96 43.3,52.1 v43.3,52.2 | U5.2 46.24,32.95 v46.7,33
  Bottom 0.5: v46.7,33 46.7,48.8 v43.3,52.2 42.9,52.6 42.9,64.5 43.6,65.2 64.4,65.2 67.7,68.5 67.7,76.17 SV1.8
D10  (via drill 0.5)
  Top 0.5: U1.30 40.66,51.76 v41.15,52.25 v49.9,61 | v55.9,61 56,61 59.8,64.8 66.5,64.8 67.9,66.2 67.9,73.3 68.5,73.9 70.5,73.9 SV1.5 | U5.9 45.16,24.05 v45.4,24.3
  Bottom 0.5: v49.9,61 v55.9,61 | v45.4,24.3 45.4,48 v41.15,52.25
D11  (via drill 0.5)
  Top 0.5: v41.4,63.7 v44.5,63.7 45.8,62.4 v45.8,60.5 | U5.12 50.34,24.05 v50,24.4 | v49.5,54.6 46.3,54.6 v46.2,54.7 | v24.5,44.7 25.1,44.1 25.76,44.1 U1.12
  Bottom 0.5: v44.5,63.7 45.2,64.4 65.7,64.4 66,64.4 70.5,68.9 70.5,73.89 SV1.6 | v41.4,63.7 37.1,63.7 33.5,60.1 28.1,60.1 28.1,58.5 27.2,57.6 25.6,57.6 24.4,56.4 24.4,44.5 v24.5,44.7 | v50,24.4 47.2,24.4 46.6,25 46.6,31 47.5,31.9 49.3,31.9 50,32.6 50,54.1 v49.5,54.6 | v46.2,54.7 46.2,60.1 v45.8,60.5
D12  (via drill 0.5)
  Top 0.5: U5.19 48.66,32.95 v48.4,33 | U1.26 44.34,48.56 45.3,47.6 v47.9,47.6
  Bottom 0.406: SV1.3 73,71.39 73,68.2 67.4,62.6
  Bottom 0.5: v48.4,33 47.9,33.7 v47.9,47.6 47.9,60.9 49.6,62.6 67.4,62.6
D13  (via drill 0.5)
  Top 0.5: U1.32 37.46,53.36 v38.4,54.3 42.8,58.7 43.9,58.7 v44,58.6 | v43.1,41.7 43.4,41.7 43.7,41.4 56.1,41.4 v57.2,40.3 | SV1.4 69.28,72.62 70.5,71.4 70.5,67.3 v69.6,66.4
  Bottom 0.5: v44,58.6 44,61.4 46.1,63.5 66.4,63.5 69.5,66.5 v69.6,66.4 | v38.4,54.3 38.4,50.8 42.3,46.9 42.3,42.5 v43.1,41.7 | v57.2,40.3 57.2,24.3 60,21.5 61.48,21.5 R3.2
D14  (via drill 0.5)
  Top 0.5: U1.11 22.76,46.16 20.1,43.5 10,43.5 9.95,43.45 | 9.95,43.45 8.4,41.9 8.4,30.2 9.17,29.43 JP2.2 9,26.17 | JP1.5 3.53,53.57 4.8,52.3 4.8,49.1 | 4.8,49.1 4.8,48.6 9.95,43.45 | v19.9,70.4 19.1,69.6 12.2,69.6 11.8,69.2 11.8,59.5 13.6,57.7 13.6,54.9 13,54.3 11.1,54.3 10.2,53.4 10.2,50.1 9.2,49.1 4.8,49.1
  Bottom 0.5: U$2.P$7 20.95,79.85 20.4,79.3 20.4,70.9 v19.9,70.4
D15  (via drill 0.5)
  Top 0.5: U1.9 16.4,47.76 v15.9,47.76 7.94,47.76 v7.9,47.8 | JP2.3 6.63,29.43 7.4,30.2 7.4,43.3 3.6,47.1 3.6,50.98 JP1.7 | U$2.P$5 18.95,79.85 17.9,78.8 17.9,71.4 v18.4,70.9
  Bottom 0.5: v7.9,47.8 4.6,47.8 3.6,48.8 3.6,50.98 JP1.7 | v18.4,70.9 18.4,67.8 16.4,65.8 16.4,48.26 v15.9,47.76
D16  (via drill 0.5)
  Top 0.5: v65.6,13.1 61.73,16.98 S3.3 59.52,15 v36.7,15 | v36.6,19.7 24.1,19.7 v23.4,20.4 | U1.10 21.36,46.96 v20.6,46.2 12,46.2 v11.3,45.5 | U$2.P$6 19.09,82.39 17.8,81.1 15.9,81.1 15.4,80.6 15.4,71.5 14.6,70.7 12.1,70.7 11,69.6 11,59.8 9.1,57.9 9.1,54.8 7.85,53.55 6.11,53.55 JP1.6
  Bottom 0.5: v65.6,13.1 73.48,13.1 R15.2 | v36.7,15 36.7,19.6 v36.6,19.7 | v23.4,20.4 23.4,38 20.7,40.7 20.7,46.3 v20.6,46.2 | JP1.6 7.81,53.59 10.7,50.7 10.7,46.6 11.3,46 v11.3,45.5
D17/PB0/RXLED  (via drill 0.5)
  Top 0.5: v59.5,88.5 56.4,88.5 55.3,87.4 46.2,87.4 45.7,87.9 33.5,87.9 v31.3,90.1 | U1.8 20.44,48.56 v20.1,48.9 | v20.2,87.6 20.2,91.2 v20.1,91.3
  Bottom 0.5: R10.2 59.18,85.12 58.7,85.6 58.7,87.7 v59.5,88.5 | v20.1,48.9 20.1,49 19.1,50 19.1,59.6 18.6,60.1 18.6,62.6 24.6,68.6 24.6,83.5 20.5,87.6 v20.2,87.6 | v20.1,91.3 30.1,91.3 v31.3,90.1
D+
  Top 0.5: U1.4 16.34,51.76 15.3,52.8 15.3,55.18 R1.1
D-
  Top 0.5: U1.3 20.04,52.56 19,53.6 R2.1
EN  (via drill 0.5)
  Top 0.4: U3.2 53.98,82.58 v54,82.6
  Top 0.5: R21.1 54.7,89.6 v55.2,89.1
  Bottom 0.5: v55.2,89.1 55.2,88.6 54.2,87.6 54.2,82.8 v54,82.6
GND  (via drill 0.5)
  Top 0.5: U1.5 15.14,50.96 13.5,52.6 12.28,52.6 C16.1 | U1.43 26.82,58.58 v26.5,58.9
  other vias: 33.5,58.9 24.3,43.3 21.9,43.5 40.6,58.6 42.4,70.7 38.9,61 39.3,26.9 33.6,31.4 21.2,69.8 23.3,71.1 25.9,70.9 28.15,72.41
  pour Bottom: 0,100 80,99.8 80,94 74.5,94 74.5,64 80,64 80,0 0,0
  pour Top: 0,100 80,100 80,94 74.5,94 74.5,64 80,64 80,0 0,0
M1_O1  (via drill 0.5)
  Top 0.5: U5.3 47.52,31.68 v49,30.2 | v54.2,35.5 55.5,36.8 73.6,36.8 v74.4,36 | v72.5,48.5 72.5,52.1 73.8,53.4 73.8,56.4 74.9,57.5 76.43,57.5 JP3.2
  Bottom 0.5: v49,30.2 49,30.3 v54.2,35.5 | v74.4,36 75.2,36.8 75.2,45.8 v72.5,48.5
  Bottom 1.016: C12.1 77.9,58.97 JP3.2
M1_O2  (via drill 0.5)
  Top 0.61: U5.8 47.62,25.32 v48.8,26.5 | v54.2,30.5 58.1,34.4 71.1,34.4 v72.4,33.1
  Bottom 0.61: v48.8,26.5 49.5,26.5 v54.2,30.5 | v72.4,33.1 76.2,33.1 78,34.9 78,50.9 C13.1
  Bottom 1.016: C13.1 77.9,53.63 JP3.1
M2_O1  (via drill 0.5)
  Top 0.61: U5.13 54.02,25.32 54.3,25.6 54.3,28.6 58.9,33.2 69.9,33.2 v70.7,32.4
  Bottom 0.61: v70.7,32.4 69.2,33.9 C15.1
  Bottom 1.016: C15.1 69.2,53.13 JP4.1
M2_O2  (via drill 0.5)
  Top 0.61: U5.18 53.17,31.68 53.2,31.7 53.5,31.7 57.4,35.6 72,35.6 v73.4,34.2 | v76.5,47.9 76.4,47.9 75.6,47.1 71.3,47.1 68.5,49.9 68.5,56.5 69.4,57.4 70.93,57.4 JP4.2
  Bottom 0.61: v73.4,34.2 75.4,34.2 76.7,35.5 76.7,47.3 v76.5,47.9
  Bottom 1.016: C14.1 69.3,59.17 JP4.2
N$1  (via drill 0.5)
  Top 0.406: U3.5 42.23,83.88 40.1,86 37.3,86 v36.95,85.65
  Top 0.5: R22.1 36.2,78.22 36.2,84.9 36.3,85 v36.95,85.65 | R20.1 v39.4,89.7
  Bottom 0.5: v39.4,89.7 39.4,88.1 v36.95,85.65
N$2
  Top 0.5: C1.2 28.6,36.1 X1.2 30.02,37.98 U1.17
N$3  (via drill 0.5)
  Top 0.5: v40.8,75.3 42,74.1 48.18,74.1 F1.1
  Bottom 0.5: v40.8,75.3 43,77.5 43,86.1 40.7,88.4 40.7,91.1 42.6,93 42.6,96.1 41.7,97 38.5,97 38,97.5 S1.5
N$4
  Top 0.406: L1.P$2 47.45,81.23 U3.1
N$5
  Top 0.5: X1.1 24.09,36.29 C2.2 23.7,36.36 23.7,37.2 24.7,38.2 28.1,38.2 29.22,39.32 U1.16
N$6  (via drill 0.5)
  Top 0.406: v66,89.5 66,88.4 LED2.C
  Bottom 0.406: R9.2 65.55,89.05 v66,89.5
N$7  (via drill 0.5)
  Top 0.406: U3.6 44.58,83.22 v45.2,82.6
  Bottom 0.5: v45.2,82.6 45.52,82.6 R23.1
N$8  (via drill 0.5)
  Top 0.406: v63.5,88 61.62,88
  Top 0.5: 61.62,88 LED1.C
  Bottom 0.406: R10.1 63.46,87.96 v63.5,88
N$9  (via drill 0.5)
  Top 0.5: R6.2 v63.5,74.9
  Bottom 0.5: R6.2 63.52,74.92 v63.5,74.9
N$10  (via drill 0.5)
  Top 0.5: R11.2 27.58,75.92 v27.2,76.3
  Bottom 0.5: v27.2,76.3 27.35,76.5 U4.5
N$11  (via drill 0.5)
  Top 0.5: v27.3,80.9 31.5,80.9 33.2,79.2 33.2,74.5 34.2,73.5 37.8,73.5 38.4,74.1 40.7,74.1 42.1,72.7 50.7,72.7 v51.1,72.3
  Bottom 0.5: U4.1 28,80.2 v27.3,80.9 | v51.1,72.3 53.6,72.3 57.8,76.5 R6.1
N$12  (via drill 0.5)
  Top 0.5: CN1.D+ 65.25,94.95 64.4,95.8 60.8,95.8 59,94 v59,93.7 | v19.9,61.2 17.2,61.2 15.8,59.8 15.8,58.52 R1.2 | v32.7,86.3 33.2,86.8 44.5,86.8 45.6,85.7 52.5,85.7 v53,86.2
  Bottom 0.5: v32.7,86.3 32.7,72.4 21.5,61.2 v19.9,61.2 | v53,86.2 53.1,86.3 53.1,89.8 54.8,91.5 56.8,91.5 v59,93.7
N$13  (via drill 0.5)
  Top 0.5: R2.2 20.92,58.12 v21,58.2 | CN1.D- 65.3,91.97 65.3,90.7 64.6,90 61.6,90 60.2,91.4 v43.8,91.4
  Bottom 0.5: v21,58.2 21,59.1 33.5,71.6 35.8,71.6 38.4,74.2 41.9,74.2 44.4,76.7 44.4,81.2 44.1,81.5 44.1,91.1 v43.8,91.4
N$14  (via drill 0.5)
  Top 0.5: LED3.C 63.52,78.52 v63.5,78.5
  Bottom 0.5: v63.5,78.5 63.5,80.28 LED3.C
N$15
  Top 0.5: F1.2 54.35,75.7 D3.A
N$19
  Top 0.61: LED5.A R8.1
N$308  (via drill 0.5)
  Top 0.5: v66.6,20.6 66.6,21.8 RGB.1
  Bottom 0.5: R3.1 65.8,21.4 v66.6,20.6
N$309  (via drill 0.5)
  Top 0.5: v68.4,25 RGB.2
  Bottom 0.5: R4.1 v68.4,25
N$310  (via drill 0.5)
  Top 0.5: v66.7,29.1 66.7,28.3 RGB.3
  Bottom 0.5: R5.1 66.2,28.6 v66.7,29.1
PD5/TXLED  (via drill 0.5)
  Top 0.5: U1.22 34.86,44.36 v35,44.5 | v38.5,62.6 38.5,70 v39.5,70.8 | v59.7,86.5 56.5,86.5 v56,86.5
  Bottom 0.5: v35,44.5 35,54.2 37,56.2 37,57.1 37.7,57.8 37.7,61.8 v38.5,62.6 | R9.1 64.84,85.16 63.5,86.5 v59.7,86.5 | v39.5,70.8 40.6,70.8 44.3,74.5 52,74.5 55.4,77.9 55.4,85.9 v56,86.5
RST  (via drill 0.5)
  Top 0.5: v10.9,42.1 14.6,42.1 | 14.6,42.1 26.2,42.1 26.82,42.72 U1.13 | v56.4,42.9 42.6,42.9 41.5,41.8 41.5,37.5 v41.1,37.1 | v35.3,25.9 19.1,25.9 16.2,23 v14.6,23 | v14.5,36.4 14.5,42 14.6,42.1 | v61.6,52.8 59.51,52.8 S4.B2 59.5,52.8 v61.6,52.8
  Bottom 0.5: JP1.8 8.15,51.05 9.7,49.5 9.7,43.3 v10.9,42.1 | R12.1 v61.6,52.8 59.6,52.8 56.4,49.6 v56.4,42.9 | v41.1,37.1 38.4,37.1 37,35.7 37,27.6 v35.3,25.9 | v14.6,23 14.6,36.3 v14.5,36.4
RX  (via drill 0.5)
  Top 0.5: Q2.2 2.25,77.83 2.72,78.3 | 2.72,78.3 R19.1 2.8,78.4 2.9,78.4 3,78.5 | v19.2,86.4 19.1,86.4 18.6,86.9 18.6,89 v16.4,91.2 | 2.72,78.3 1.3,78.3 0.9,78.7 0.9,82.9 2,84 2,89.9 3.4,91.3 v8.6,91.3 11.5,91.3 | 11.64,91.3 11.5,91.3 | U6.2 11.59,91.21 | 11.59,91.21 11.6,91.2 | 11.59,91.21 11.5,91.3
  Bottom 0.5: v16.4,91.2 8.7,91.2 v8.6,91.3 | U$1.RX 22.36,77.66 23,78.3 23,83.4 20,86.4 v19.2,86.4
TX  (via drill 0.5)
  Top 0.5: v14.4,86.1 14,86.5 14,91.9 13.09,92.81 11.55,92.81 U6.1 | v7,83.6 7.9,83.6 8.7,82.8 8.7,78.9 8.1,78.3 7.08,78.3 R13.1 6.65,78.23 Q1.2
  Bottom 0.5: v14.4,86.1 9.5,86.1 v7,83.6 7,82.2 U$1.TX
UCAP
  Top 0.5: U1.6 15.76,50.16 15.4,49.8 12.28,49.8 C16.2
V_AUX
  Top 1.27: S2.3 4.33,15.85 CN3.1
V_MOT  (via drill 0.5)
  Top 0.813: U5.10 26.71,22.79 25.5,24 21,24 17.2,20.2 v15.5,20.2
  Bottom 0.813: S2.2 14.3,19 v15.5,20.2
VBAT
  Top 0.5: JP7.1 44.23,93.73 42.3,91.8 36.1,91.8 35.5,92.4 S1.1
  Bottom 0.813: CN2.2 36.2,82.9 35.5,83.6 S1.1
VBUS  (via drill 0.5)
  Top 0.5: v13.2,64.8 13.6,64.4 23,64.4 25.3,66.7 25.3,69.3 25.8,69.8 v28.4,69.8 34.2,69.8 36.5,72.1 41.2,72.1 41.5,71.8 44.6,71.8 44.8,71.6 v45,71.6 | v57.8,73.1 57.8,73.3 58.9,74.4 58.9,76.3 59,76.4 | v3,65.8 3,65.7 2,64.7 2,23.27 JP5.2 | S1.6 45.25,98.65 46.8,97.1 46.8,94.7 49.2,92.3 62.47,92.3 CN1.VBUS | C22.1 30.4,83.2 v29,84.6
  Top 0.61: v58.3,78.2 58.3,77.1 59,76.4 60.58,76.4 LED4.A
  Top 1.016: JP5.2 JP6.2
  Bottom 0.5: v45,71.6 48.9,71.6 50.7,69.8 54.5,69.8 v57.8,73.1 | v13.2,64.8 4,64.8 v3,65.8 | v28.4,69.8 29.95,71.35 U4.4 29.9,77.25 29.9,77.8 29.2,78.5 27,78.5 25.8,79.7 25.8,81.8 28.6,84.6 v29,84.6
  Bottom 0.61: CN1.VBUS 61.02,92.02 57.7,88.7 57.7,83.3 58.6,82.4 58.6,78.5 v58.3,78.2
VCC  (via drill 0.5)
  Top 0.5: 26.02,63.02 26.02,60.52 25.3,59.8 25.3,58 26.02,57.28 U1.44 26.02,53.5 25.88,53.36 | C6.2 27.1,67.9 27.1,66.2 26.02,65.12 26.02,63.02 | C5.2 40.2,60.5 38.5,58.8 35.2,58.8 34.06,57.66 34.06,56 U1.34 34.02,54.82 33.2,54 33.2,52.1 31,49.9 31,49.4 | U1.7 26.04,49.36 26.1,49.3 | U1.2 25.88,53.36 | S3.1 66.5,17.4 67.4,17.4 v68.85,18.85 | C8.2 20.7,36.4 23.6,39.3 26.8,39.3 27.62,40.12 U1.14 27.62,45.38 26.1,46.9 26.1,49.3 | v49.2,11 47.97,9.77 U2.3 47.97,8.47 47.4,7.9 45.9,7.9 | U5.1 39.72,34.22 C24.A 38.9,33.8 | U5.1 U5.20 C23.A | U5.1 39.12,34.22 | 39.12,34.22 38.8,33.9 | 26.02,63.02 26,63 v14.9,63 | 39.12,34.22 39.12,39.22 39.9,40 39.9,43.4 39,44.3 37.9,44.3 C7.2 38,44.4 38,46.3 37.34,46.96 U1.24 33.84,46.96 31.8,49 31.4,49 31,49.4 | 26.1,49.3 26.1,53.14 25.88,53.36 | 31,49.4 26.2,49.4 26.1,49.3 | 45.9,7.9 43.5,7.9 v42.5,6.9 | U2.1 46.07,8.07 45.9,7.9 | LED3.A 56.85,80.3 D3.C
  Top 0.813: C8.2 17.7,36.4 16.9,35.6 16.9,27 15.9,26 JP2.1 11.71,18.21 15.49,18.21 16.8,16.9 S2.1 | C11.1 52.1,22.7 U5.11 48.28,22.79 v47.5,22 | v41.5,35.5 41,35.5 C24.A | LED3.A 60.68,84.22 LED1.A
  Top 1.016: v61.6,60.4 61.6,60.6 62.4,61.4 62.5,61.4 64.5,63.4 69.2,63.4 71.77,65.97 SV1.1 72.78,70.08 73.5,70.8 73.5,88.6 72.4,89.7 68.8,89.7 67.5,88.4 67.5,85.7 67,85.2 65.64,85.2 LED2.A 61.57,85.11 LED1.A | JP1.1 3.53,64.43 5.2,66.1 5.2,68.2 | C11.1 v51.3,19.5 | 5.2,68.2 3.08,68.2 R18.2 | 5.2,68.2 7.42,68.2 R17.2
  Bottom 0.5: v49.2,11 49.2,17.4 v51.3,19.5 | v14.9,63 4.63,63 3.53,61.9 JP1.1 | C18.1 42.5,7.9 v42.5,6.9 40.83,5.23 SV2.15
  Bottom 0.813: v47.5,22 42.5,22 41,23.5 41,35 v41.5,35.5
  Bottom 1.016: R12.2 v61.6,60.4 65.4,56.6 65.4,49.2 67.6,47 67.6,33 72.1,28.5 LDR.1 72.1,22.1 v68.85,18.85 68.8,18.8 51.9,18.8 51.8,18.9 51.8,19 v51.3,19.5
VIN  (via drill 0.5)
  Top 0.4: U3.3 47.83,83.22 v48.7,84.1
  Top 0.5: v48.7,84.1 48.8,84.2 | 48.8,84.2 50.6,84.2 | 50.6,84.2 51.57,84.2 L1.P$1 | 50.6,84.2 50.28,84.52 49.12,84.52 48.8,84.2 | R21.2 v48,89.6 C10.1 | S1.2 38,93.6 38.5,93.1 | 38.5,93.1 41.83,93.1 JP7.2 | 38.5,93.1 38.5,95.3 36.7,97.1 34.5,97.1 v32.2,94.8 | C26.1 30.4,77.9 v31.6,76.7 31.6,76.6 32,76.2 32,74.5 33.7,72.8 39,72.8 v39.4,73.2 | v36.8,70.5 36.2,70.5 35.1,69.4 35.1,64.9 32.42,62.22 U1.36
  Bottom 0.5: JP7.2 45.73,96.27 47.1,94.9 47.1,90.5 v48,89.6 48.7,88.9 v48.7,84.1 | v32.2,94.8 32.2,87.5 31.2,86.5 31.2,81.05 30.43,80.28 | 30.43,80.28 U4.3 | v31.6,76.7 31.6,79.1 30.43,80.28 | v39.4,73.2 39.4,73.1 v36.8,70.5
VOUT  (via drill 0.5)
  Top 0.406: U3.7 41.1,82.58 41.1,82.6
  Top 0.5: R22.2 37.8,76.82 37.8,75.5 37.1,74.8 v35.1,74.8
  Top 1.016: 41.1,82.6 40.7,82.6 | 40.7,82.6 38.35,82.6 | 38.35,82.6 D2.C | D1.C 38.35,82.6 | 40.7,79.48 40.7,76.9 R22.2 | 40.7,79.48 40.7,82.6 | C21.2 43.48,75.7 C17.2 40.7,79.48
  Bottom 0.5: S1.4 35.05,98.65 33.4,97 33.4,88.1 34.2,87.3 34.2,75.7 v35.1,74.8

### Text on the board
tPlace: CN1 | Bluetooth / Config | RGB | + | Solar / Input | - | + | Motor / Power | Ext | Bat | - | S3
tNames: ON | OFF | ElectroLab | VCC | GND | Reset | Motores | Rx | Tx | S4 | A | B | MOSI | MISO | SCK | RST | GND | Rx | Tx | VCC | Mod Interface
bNames: VCC | GND | Rx | Tx | MOSI | MISO | SCK | RST